# EAGLE schematic Z573 Holder Mark1 (EAGLE 9.6.2)
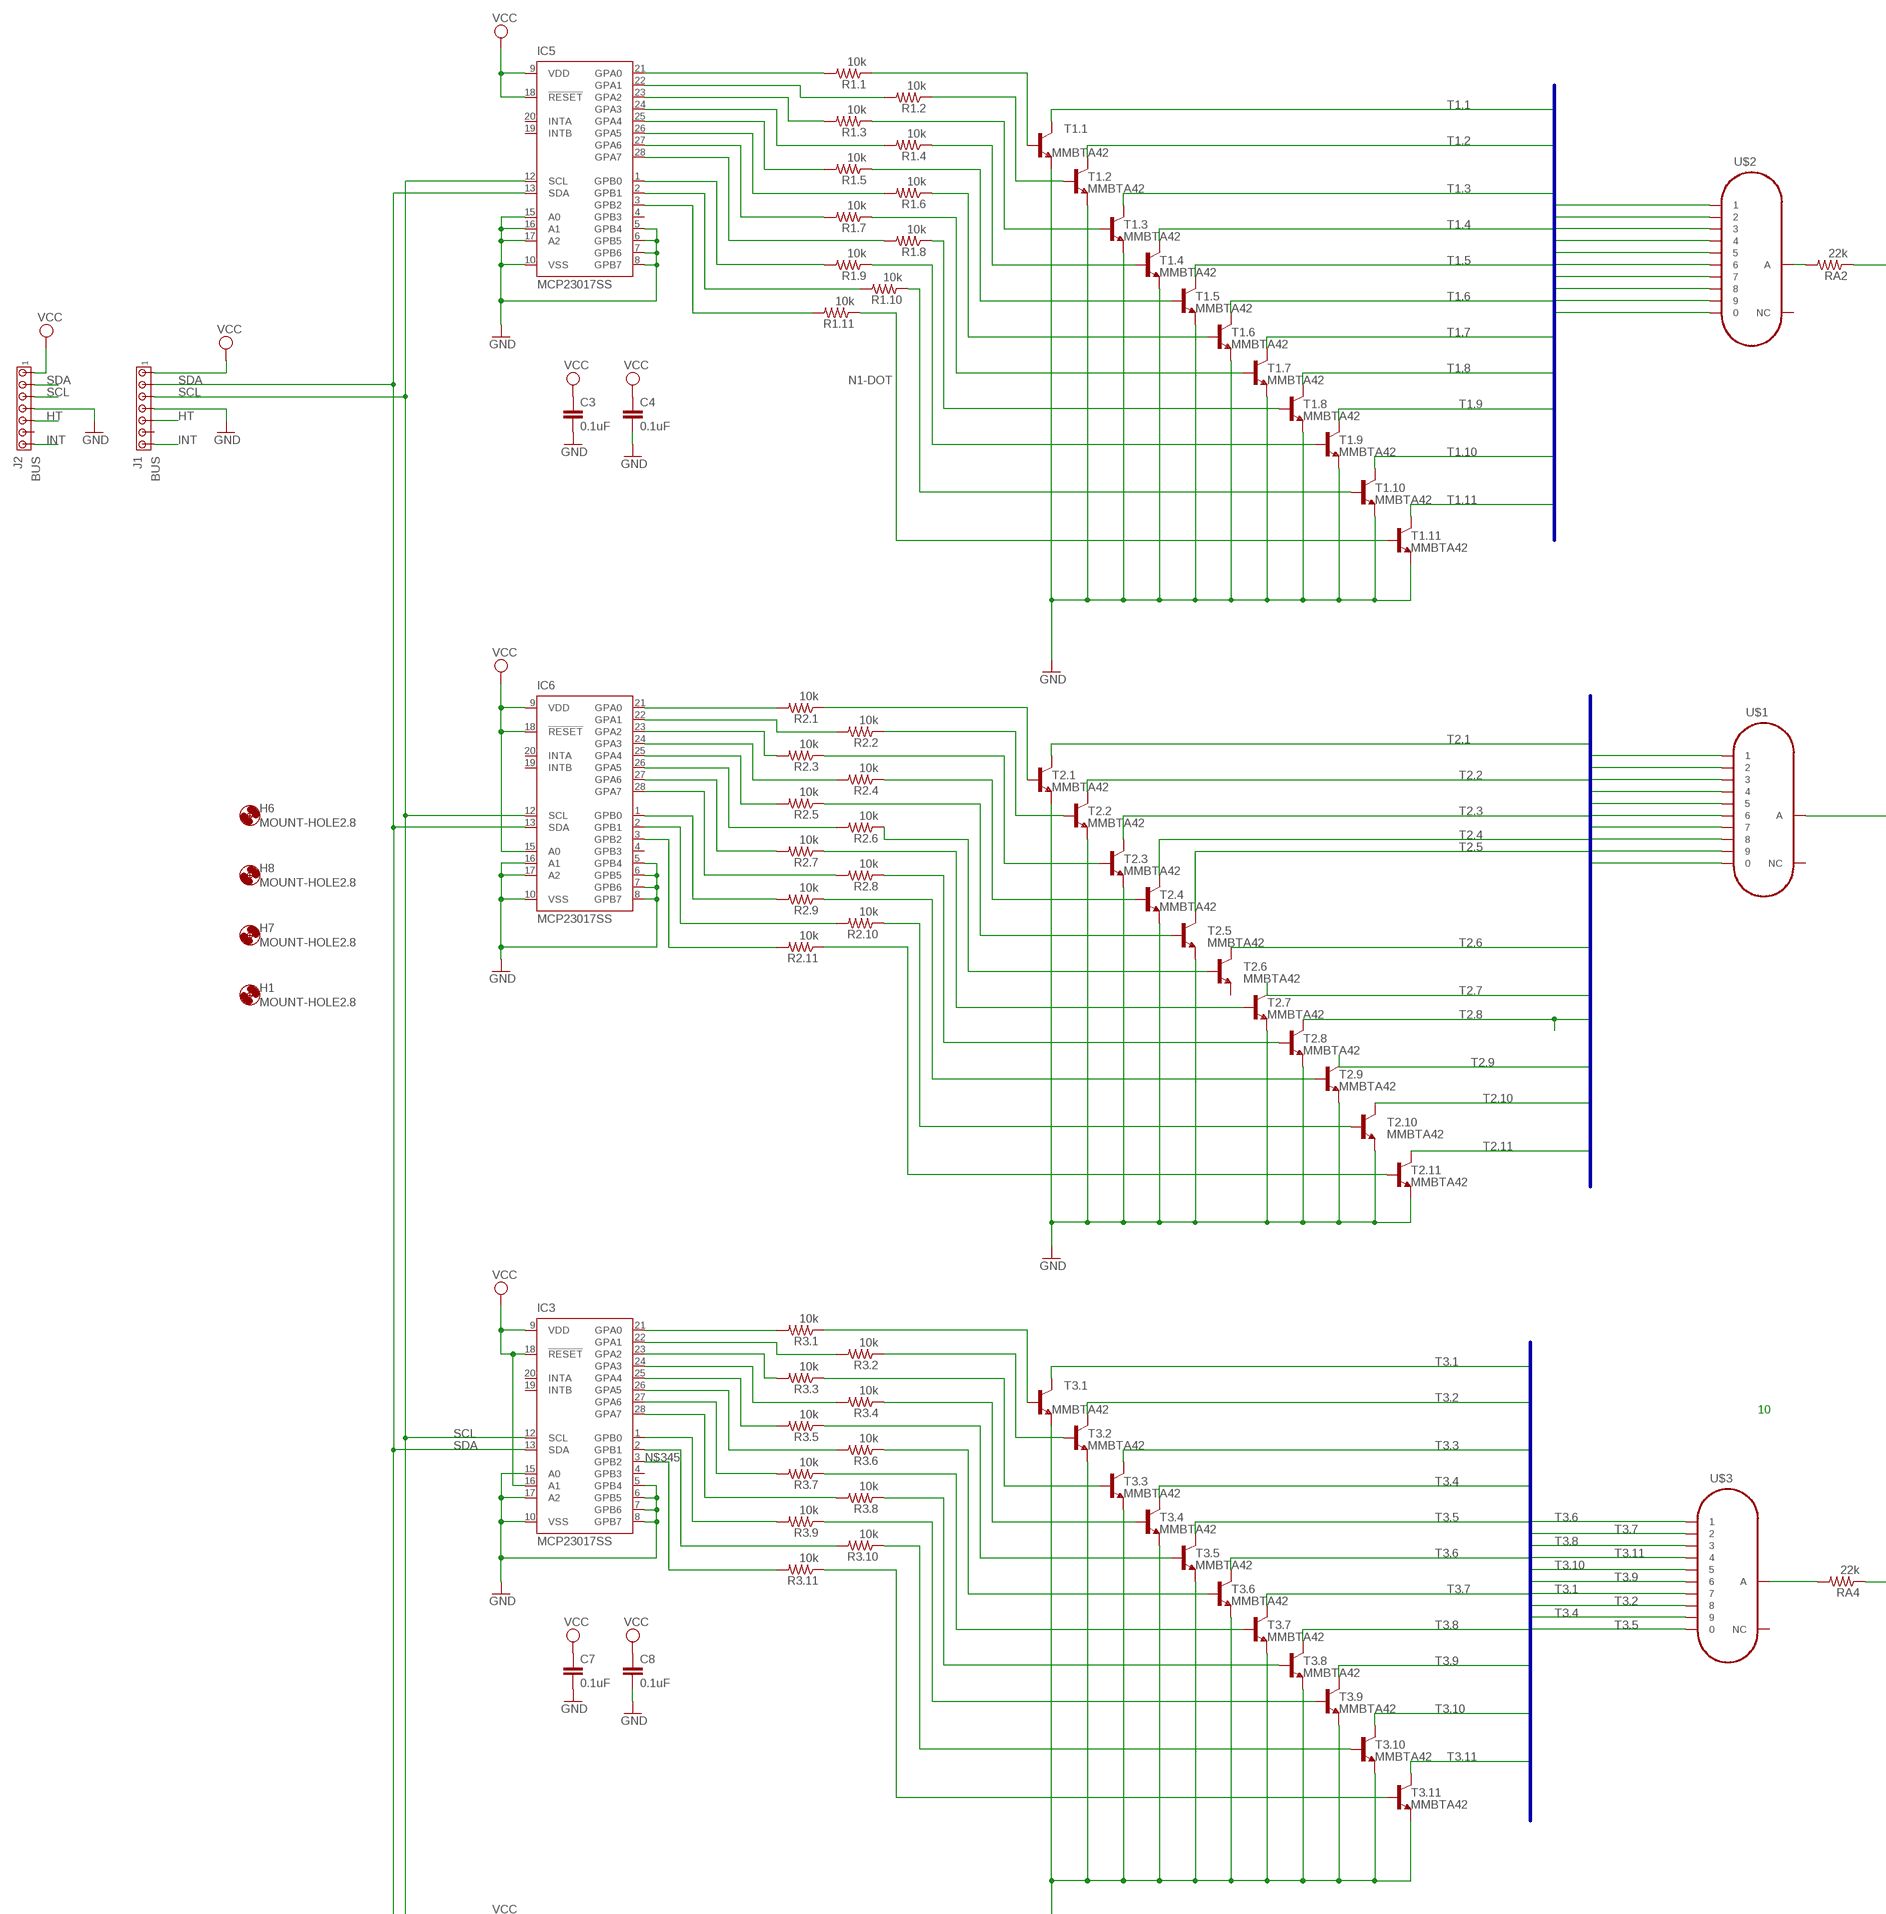
[diagram p0: schematic, sheet 1, part 1 of 3]
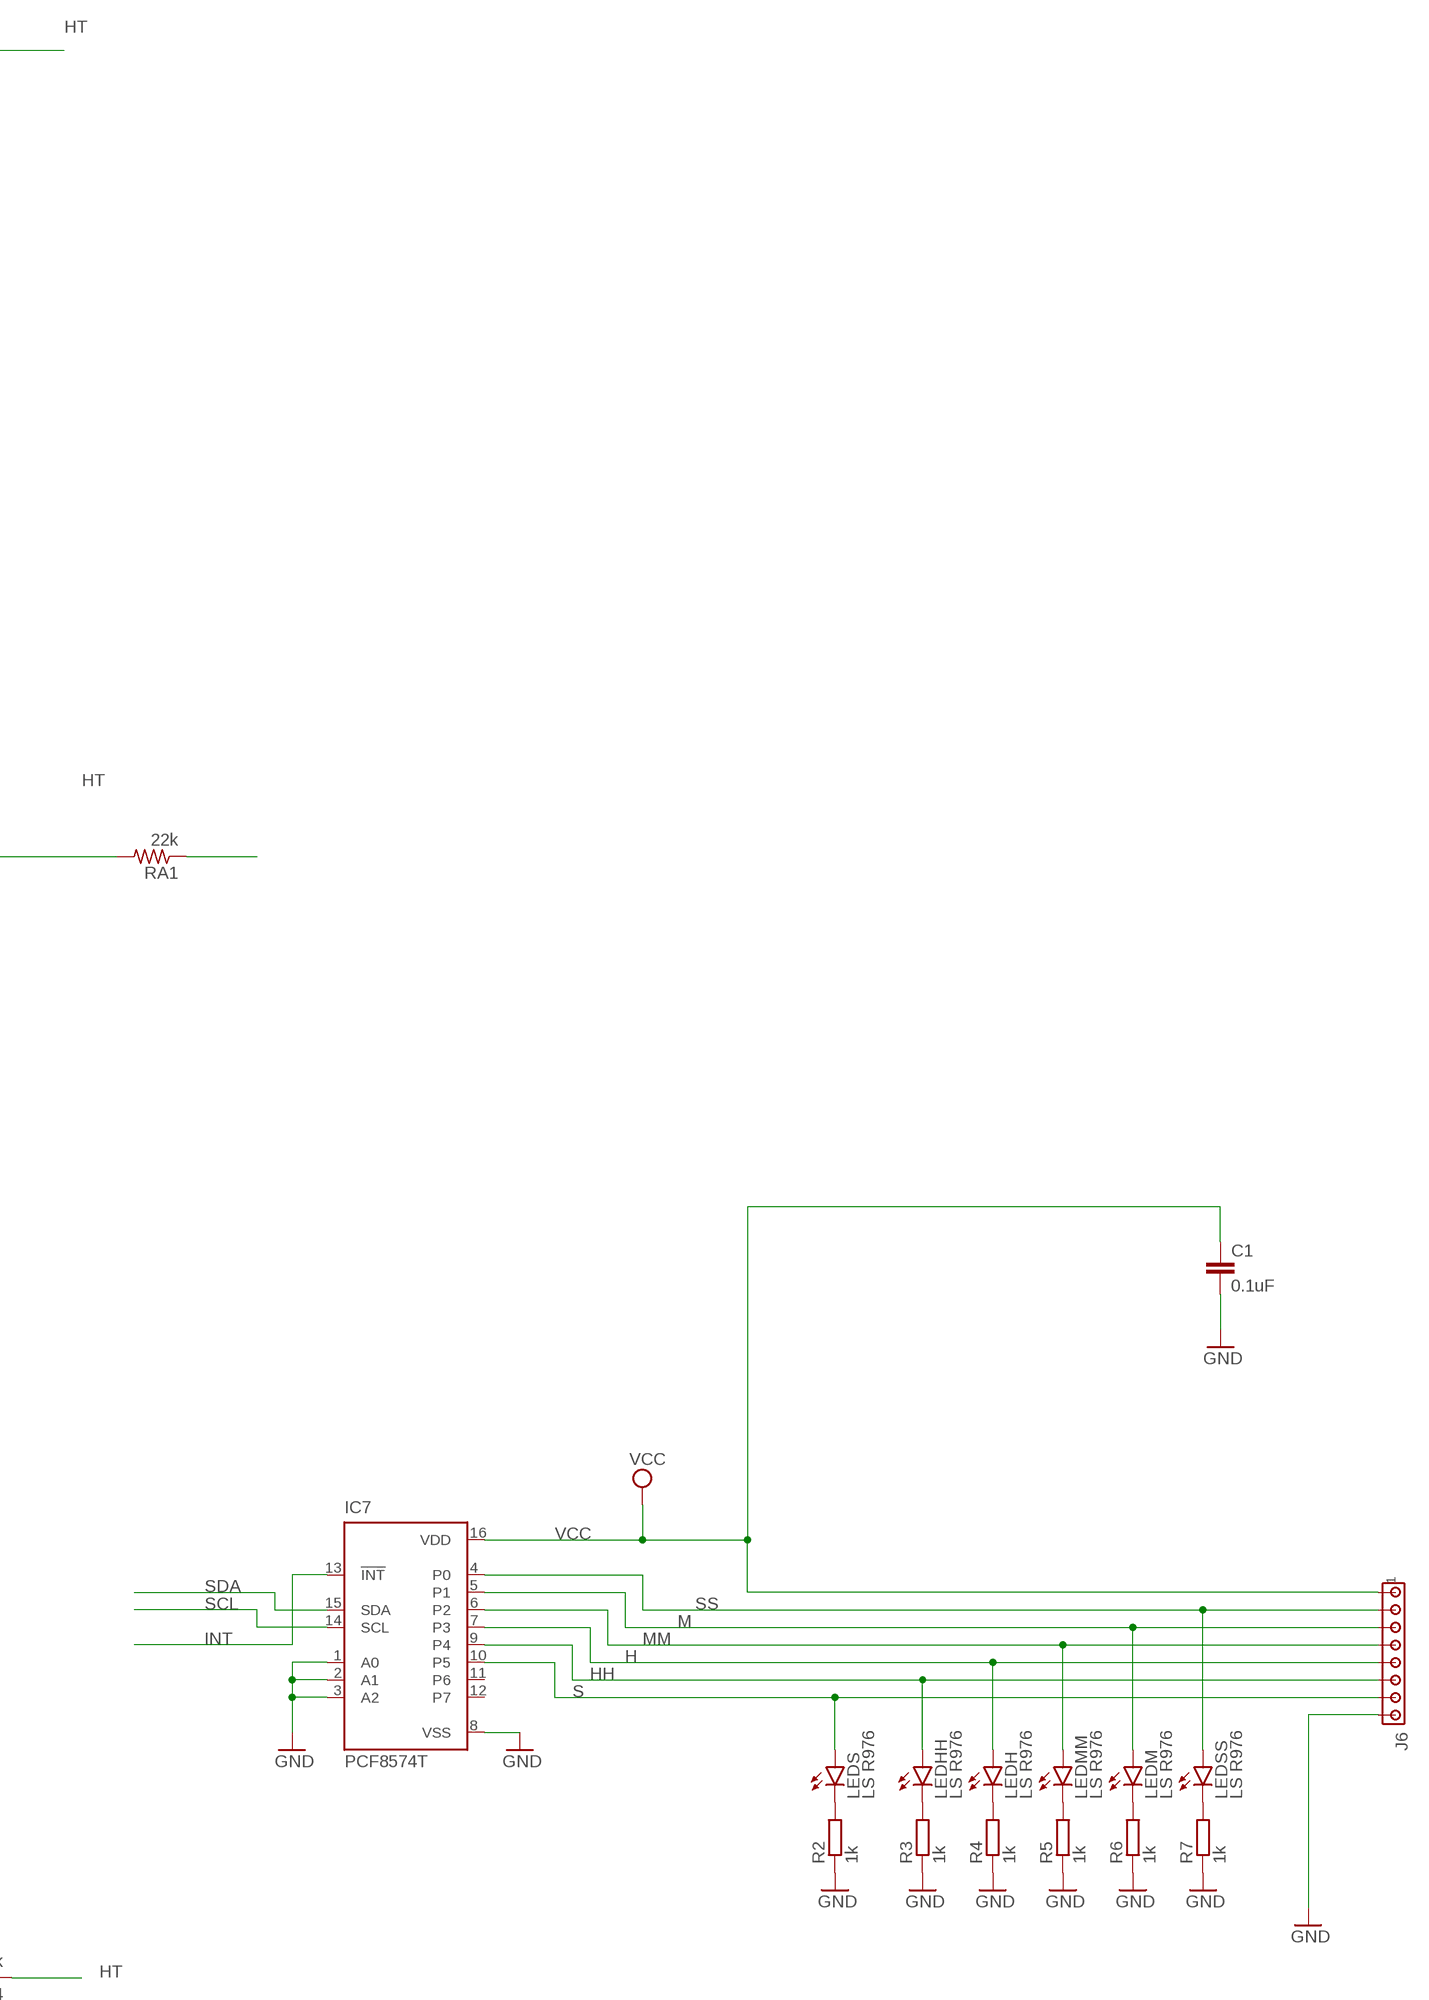
[diagram p1: schematic, sheet 1, part 2 of 3]
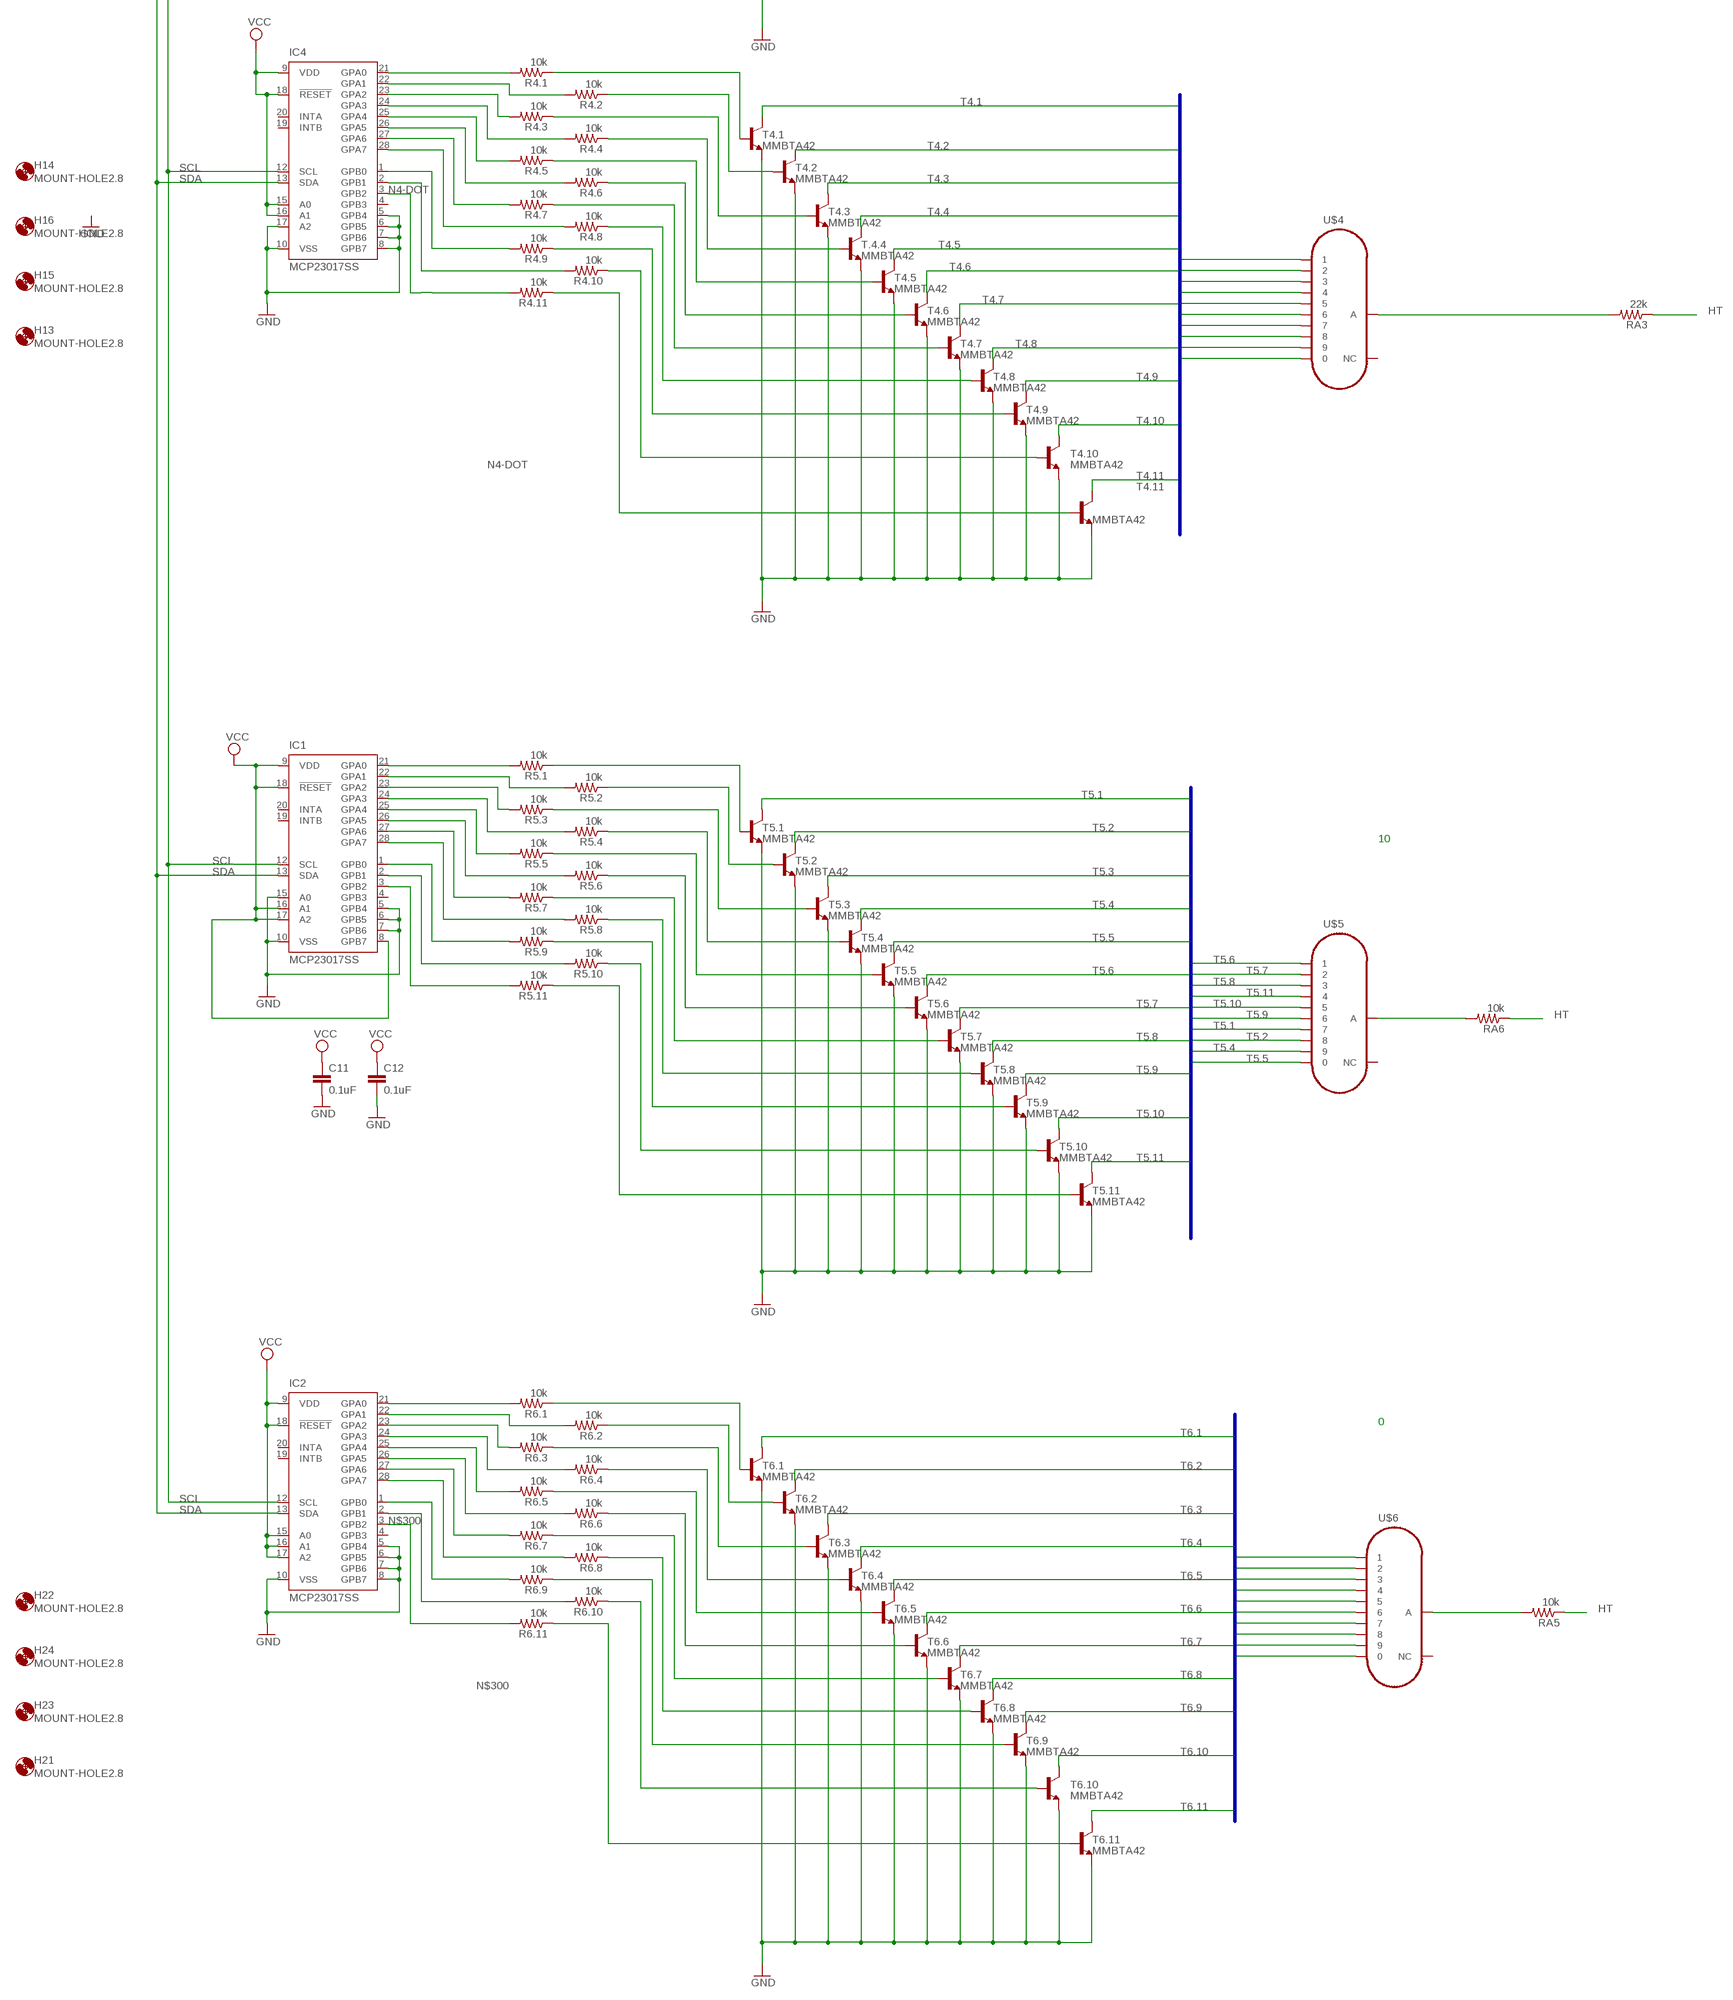
[diagram p2: schematic, sheet 1, part 3 of 3]

## Parts
C1  0.1uF  C-EUC0805  [C0805]
C3  0.1uF  C-EUC0805  [C0805]
C4  0.1uF  C-EUC0805  [C0805]
C7  0.1uF  C-EUC0805  [C0805]
C8  0.1uF  C-EUC0805  [C0805]
C11  0.1uF  C-EUC0805  [C0805]
C12  0.1uF  C-EUC0805  [C0805]
H1  MOUNT-HOLE2.8  [2,8]
H6  MOUNT-HOLE2.8  [2,8]
H7  MOUNT-HOLE2.8  [2,8]
H8  MOUNT-HOLE2.8  [2,8]
H13  MOUNT-HOLE2.8  [2,8]
H14  MOUNT-HOLE2.8  [2,8]
H15  MOUNT-HOLE2.8  [2,8]
H16  MOUNT-HOLE2.8  [2,8]
H21  MOUNT-HOLE2.8  [2,8]
H22  MOUNT-HOLE2.8  [2,8]
H23  MOUNT-HOLE2.8  [2,8]
H24  MOUNT-HOLE2.8  [2,8]
IC1  MCP23017SS  [SSOP28]
IC2  MCP23017SS  [SSOP28]
IC3  MCP23017SS  [SSOP28]
IC4  MCP23017SS  [SSOP28]
IC5  MCP23017SS  [SSOP28]
IC6  MCP23017SS  [SSOP28]
IC7  PCF8574T  [SO16W]
J1  BUS  MTA07-100  [10X07MTA]
J2  BUS  MTA07-100  [10X07MTA]
J6  MTA08-100  [10X08MTA]
LEDH  LS R976  LEDSML0805  [SML0805]
LEDHH  LS R976  LEDSML0805  [SML0805]
LEDM  LS R976  LEDSML0805  [SML0805]
LEDMM  LS R976  LEDSML0805  [SML0805]
LEDS  LS R976  LEDSML0805  [SML0805]
LEDSS  LS R976  LEDSML0805  [SML0805]
R1.1  10k  R-US_R0603  [R0603]
R1.2  10k  R-US_R0603  [R0603]
R1.3  10k  R-US_R0603  [R0603]
R1.4  10k  R-US_R0603  [R0603]
R1.5  10k  R-US_R0603  [R0603]
R1.6  10k  R-US_R0603  [R0603]
R1.7  10k  R-US_R0603  [R0603]
R1.8  10k  R-US_R0603  [R0603]
R1.9  10k  R-US_R0603  [R0603]
R1.10  10k  R-US_R0603  [R0603]
R1.11  10k  R-US_R0603  [R0603]
R2  1k  R-EU_R0805  [R0805]
R2.1  10k  R-US_R0603  [R0603]
R2.2  10k  R-US_R0603  [R0603]
R2.3  10k  R-US_R0603  [R0603]
R2.4  10k  R-US_R0603  [R0603]
R2.5  10k  R-US_R0603  [R0603]
R2.6  10k  R-US_R0603  [R0603]
R2.7  10k  R-US_R0603  [R0603]
R2.8  10k  R-US_R0603  [R0603]
R2.9  10k  R-US_R0603  [R0603]
R2.10  10k  R-US_R0603  [R0603]
R2.11  10k  R-US_R0603  [R0603]
R3  1k  R-EU_R0805  [R0805]
R3.1  10k  R-US_R0603  [R0603]
R3.2  10k  R-US_R0603  [R0603]
R3.3  10k  R-US_R0603  [R0603]
R3.4  10k  R-US_R0603  [R0603]
R3.5  10k  R-US_R0603  [R0603]
R3.6  10k  R-US_R0603  [R0603]
R3.7  10k  R-US_R0603  [R0603]
R3.8  10k  R-US_R0603  [R0603]
R3.9  10k  R-US_R0603  [R0603]
R3.10  10k  R-US_R0603  [R0603]
R3.11  10k  R-US_R0603  [R0603]
R4  1k  R-EU_R0805  [R0805]
R4.1  10k  R-US_R0603  [R0603]
R4.2  10k  R-US_R0603  [R0603]
R4.3  10k  R-US_R0603  [R0603]
R4.4  10k  R-US_R0603  [R0603]
R4.5  10k  R-US_R0603  [R0603]
R4.6  10k  R-US_R0603  [R0603]
R4.7  10k  R-US_R0603  [R0603]
R4.8  10k  R-US_R0603  [R0603]
R4.9  10k  R-US_R0603  [R0603]
R4.10  10k  R-US_R0603  [R0603]
R4.11  10k  R-US_R0603  [R0603]
R5  1k  R-EU_R0805  [R0805]
R5.1  10k  R-US_R0603  [R0603]
R5.2  10k  R-US_R0603  [R0603]
R5.3  10k  R-US_R0603  [R0603]
R5.4  10k  R-US_R0603  [R0603]
R5.5  10k  R-US_R0603  [R0603]
R5.6  10k  R-US_R0603  [R0603]
R5.7  10k  R-US_R0603  [R0603]
R5.8  10k  R-US_R0603  [R0603]
R5.9  10k  R-US_R0603  [R0603]
R5.10  10k  R-US_R0603  [R0603]
R5.11  10k  R-US_R0603  [R0603]
R6  1k  R-EU_R0805  [R0805]
R6.1  10k  R-US_R0603  [R0603]
R6.2  10k  R-US_R0603  [R0603]
R6.3  10k  R-US_R0603  [R0603]
R6.4  10k  R-US_R0603  [R0603]
R6.5  10k  R-US_R0603  [R0603]
R6.6  10k  R-US_R0603  [R0603]
R6.7  10k  R-US_R0603  [R0603]
R6.8  10k  R-US_R0603  [R0603]
R6.9  10k  R-US_R0603  [R0603]
R6.10  10k  R-US_R0603  [R0603]
R6.11  10k  R-US_R0603  [R0603]
R7  1k  R-EU_R0805  [R0805]
RA1  22k  R-US_M0805  [M0805]
RA2  22k  R-US_M0805  [M0805]
RA3  22k  R-US_M0805  [M0805]
RA4  22k  R-US_M0805  [M0805]
RA5  10k  R-US_M0805  [M0805]
RA6  10k  R-US_M0805  [M0805]
T1.1  MMBTA42  BC846  [SOT23]
T1.2  MMBTA42  BC846  [SOT23]
T1.3  MMBTA42  BC846  [SOT23]
T1.4  MMBTA42  BC846  [SOT23]
T1.5  MMBTA42  BC846  [SOT23]
T1.6  MMBTA42  BC846  [SOT23]
T1.7  MMBTA42  BC846  [SOT23]
T1.8  MMBTA42  BC846  [SOT23]
T1.9  MMBTA42  BC846  [SOT23]
T1.10  MMBTA42  BC846  [SOT23]
T1.11  MMBTA42  BC846  [SOT23]
T2.1  MMBTA42  BC846  [SOT23]
T2.2  MMBTA42  BC846  [SOT23]
T2.3  MMBTA42  BC846  [SOT23]
T2.4  MMBTA42  BC846  [SOT23]
T2.5  MMBTA42  BC846  [SOT23]
T2.6  MMBTA42  BC846  [SOT23]
T2.7  MMBTA42  BC846  [SOT23]
T2.8  MMBTA42  BC846  [SOT23]
T2.9  MMBTA42  BC846  [SOT23]
T2.10  MMBTA42  BC846  [SOT23]
T2.11  MMBTA42  BC846  [SOT23]
T3.1  MMBTA42  BC846  [SOT23]
T3.2  MMBTA42  BC846  [SOT23]
T3.3  MMBTA42  BC846  [SOT23]
T3.4  MMBTA42  BC846  [SOT23]
T3.5  MMBTA42  BC846  [SOT23]
T3.6  MMBTA42  BC846  [SOT23]
T3.7  MMBTA42  BC846  [SOT23]
T3.8  MMBTA42  BC846  [SOT23]
T3.9  MMBTA42  BC846  [SOT23]
T3.10  MMBTA42  BC846  [SOT23]
T3.11  MMBTA42  BC846  [SOT23]
T4.1  MMBTA42  BC846  [SOT23]
T4.2  MMBTA42  BC846  [SOT23]
T4.3  MMBTA42  BC846  [SOT23]
T4.5  MMBTA42  BC846  [SOT23]
T4.6  MMBTA42  BC846  [SOT23]
T4.7  MMBTA42  BC846  [SOT23]
T4.8  MMBTA42  BC846  [SOT23]
T4.9  MMBTA42  BC846  [SOT23]
T4.10  MMBTA42  BC846  [SOT23]
T4.11  MMBTA42  BC846  [SOT23]
T5.1  MMBTA42  BC846  [SOT23]
T5.2  MMBTA42  BC846  [SOT23]
T5.3  MMBTA42  BC846  [SOT23]
T5.4  MMBTA42  BC846  [SOT23]
T5.5  MMBTA42  BC846  [SOT23]
T5.6  MMBTA42  BC846  [SOT23]
T5.7  MMBTA42  BC846  [SOT23]
T5.8  MMBTA42  BC846  [SOT23]
T5.9  MMBTA42  BC846  [SOT23]
T5.10  MMBTA42  BC846  [SOT23]
T5.11  MMBTA42  BC846  [SOT23]
T6.1  MMBTA42  BC846  [SOT23]
T6.2  MMBTA42  BC846  [SOT23]
T6.3  MMBTA42  BC846  [SOT23]
T6.4  MMBTA42  BC846  [SOT23]
T6.5  MMBTA42  BC846  [SOT23]
T6.6  MMBTA42  BC846  [SOT23]
T6.7  MMBTA42  BC846  [SOT23]
T6.8  MMBTA42  BC846  [SOT23]
T6.9  MMBTA42  BC846  [SOT23]
T6.10  MMBTA42  BC846  [SOT23]
T6.11  MMBTA42  BC846  [SOT23]
T.4.4  MMBTA42  BC846  [SOT23]
U$1  Z573  [Z573M]
U$2  Z573  [Z573M]
U$3  Z573  [Z573M]
U$4  Z573  [Z573M]
U$5  Z573  [Z573M]
U$6  Z573  [Z573M]

## Nets
2-E10: R2.2.1 T2.2.1(B)
2-E11: R2.3.1 T2.3.1(B)
2-E12: R2.4.1 T2.4.1(B)
2-E13: R2.5.1 T2.5.1(B)
2-E15: R2.7.1 T2.7.1(B)
2-E16: R2.8.1 T2.8.1(B)
2-E17: R2.9.1 T2.9.1(B)
2-E18: R2.10.1 T2.10.1(B)
2-E19: R2.1.1 T2.1.1(B)
2-E30: R4.2.1 T4.2.1(B)
2-E31: R4.3.1 T4.3.1(B)
2-E32: R4.4.1 T.4.4.1(B)
2-E33: R4.5.1 T4.5.1(B)
2-E34: R4.6.1 T4.6.1(B)
2-E35: R4.7.1 T4.7.1(B)
2-E36: R4.8.1 T4.8.1(B)
2-E37: R4.9.1 T4.9.1(B)
2-E38: R4.10.1 T4.10.1(B)
2-E39: R4.1.1 T4.1.1(B)
2-E50: R6.2.1 T6.2.1(B)
2-E51: R6.3.1 T6.3.1(B)
2-E52: R6.4.1 T6.4.1(B)
2-E53: R6.5.1 T6.5.1(B)
2-E54: R6.6.1 T6.6.1(B)
2-E55: R6.7.1 T6.7.1(B)
2-E56: R6.8.1 T6.8.1(B)
2-E57: R6.9.1 T6.9.1(B)
2-E58: R6.10.1 T6.10.1(B)
2-E59: R6.1.1 T6.1.1(B)
2-R12: IC6.23(GPA2) R2.3.2
2-R16: IC6.27(GPA6) R2.7.2
2-R17: IC6.28(GPA7) R2.8.2
2-R18: IC6.1(GPB0) R2.9.2
2-R19: IC6.2(GPB1) R2.10.2
2-R30: IC4.21(GPA0) R4.1.2
2-R31: IC4.22(GPA1) R4.2.2
2-R32: IC4.23(GPA2) R4.3.2
2-R33: IC4.24(GPA3) R4.4.2
2-R34: IC4.25(GPA4) R4.5.2
2-R35: IC4.26(GPA5) R4.6.2
2-R36: IC4.27(GPA6) R4.7.2
2-R37: IC4.28(GPA7) R4.8.2
2-R38: IC4.1(GPB0) R4.9.2
2-R39: IC4.2(GPB1) R4.10.2
2-R50: IC2.21(GPA0) R6.1.2
2-R51: IC2.22(GPA1) R6.2.2
2-R52: IC2.23(GPA2) R6.3.2
2-R53: IC2.24(GPA3) R6.4.2
2-R54: IC2.25(GPA4) R6.5.2
2-R55: IC2.26(GPA5) R6.6.2
2-R56: IC2.27(GPA6) R6.7.2
2-R57: IC2.28(GPA7) R6.8.2
2-R58: IC2.1(GPB0) R6.9.2
2-R59: IC2.2(GPB1) R6.10.2
GND: C1.2 C3.2 C4.2 C7.2 C8.2 C11.2 C12.2 IC1.5(GPB4) IC1.6(GPB5) IC1.7(GPB6) IC1.10(VSS) IC1.15(A0) IC2.5(GPB4) IC2.6(GPB5) IC2.7(GPB6) IC2.8(GPB7) IC2.10(VSS) IC3.5(GPB4) IC3.6(GPB5) IC3.7(GPB6) IC3.8(GPB7) IC3.10(VSS) IC3.15(A0) IC3.17(A2) IC4.5(GPB4) IC4.6(GPB5) IC4.7(GPB6) IC4.8(GPB7) IC4.10(VSS) IC4.17(A2) IC5.5(GPB4) IC5.6(GPB5) IC5.7(GPB6) IC5.8(GPB7) IC5.10(VSS) IC5.15(A0) IC5.16(A1) IC5.17(A2) IC6.5(GPB4) IC6.6(GPB5) IC6.7(GPB6) IC6.8(GPB7) IC6.10(VSS) IC6.16(A1) IC6.17(A2) IC7.1(A0) IC7.2(A1) IC7.3(A2) IC7.8(VSS) J1.4 J2.4 J6.8 R2.1 R3.1 R4.1 R5.1 R6.1 R7.1 T1.1.2(E) T1.2.2(E) T1.3.2(E) T1.4.2(E) T1.5.2(E) T1.6.2(E) T1.7.2(E) T1.8.2(E) T1.9.2(E) T1.10.2(E) T1.11.2(E) T2.1.2(E) T2.2.2(E) T2.3.2(E) T2.4.2(E) T2.5.2(E) T2.7.2(E) T2.8.2(E) T2.9.2(E) T2.10.2(E) T2.11.2(E) T3.1.2(E) T3.2.2(E) T3.3.2(E) T3.4.2(E) T3.5.2(E) T3.6.2(E) T3.7.2(E) T3.8.2(E) T3.9.2(E) T3.10.2(E) T3.11.2(E) T4.1.2(E) T4.2.2(E) T4.3.2(E) T4.5.2(E) T4.6.2(E) T4.7.2(E) T4.8.2(E) T4.9.2(E) T4.10.2(E) T4.11.2(E) T5.1.2(E) T5.2.2(E) T5.3.2(E) T5.4.2(E) T5.5.2(E) T5.6.2(E) T5.7.2(E) T5.8.2(E) T5.9.2(E) T5.10.2(E) T5.11.2(E) T6.1.2(E) T6.2.2(E) T6.3.2(E) T6.4.2(E) T6.5.2(E) T6.6.2(E) T6.7.2(E) T6.8.2(E) T6.9.2(E) T6.10.2(E) T6.11.2(E) T.4.4.2(E)
H: IC7.7(P3) J6.5 LEDH.A
HH: IC7.9(P4) J6.6 LEDHH.A
HT: J1.5 J2.5 RA1.1 RA2.1 RA3.1 RA4.1 RA5.1 RA6.1
INT: IC7.13(!INT) J1.7 J2.7
M: IC7.5(P1) J6.3 LEDM.A
MM: IC7.6(P2) J6.4 LEDMM.A
N1-DOT: IC5.3(GPB2) R1.11.2
N4-DOT: IC4.3(GPB2) R4.11.2
N$2: IC6.24(GPA3) R2.4.2
N$3: IC6.21(GPA0) R2.1.2
N$4: IC5.24(GPA3) R1.4.2
N$5: IC6.22(GPA1) R2.2.2
N$6: IC5.26(GPA5) R1.6.2
N$7: IC5.27(GPA6) R1.7.2
N$8: IC5.28(GPA7) R1.8.2
N$9: IC5.1(GPB0) R1.9.2
N$10: IC5.2(GPB1) R1.10.2
N$12: IC6.3(GPB2) R2.11.2
N$13: R2.11.1 T2.11.1(B)
N$14: RA2.2 U$2.P$13(A)
N$15: IC5.21(GPA0) R1.1.2
N$16: IC6.25(GPA4) R2.5.2
N$17: RA4.2 U$3.P$13(A)
N$18: IC6.26(GPA5) R2.6.2
N$19: R2.6.1 T2.6.1(B)
N$27: R1.2.1 T1.2.1(B)
N$31: LEDS.C R2.2
N$32: LEDHH.C R3.2
N$33: LEDH.C R4.2
N$34: LEDMM.C R5.2
N$36: LEDM.C R6.2
N$38: LEDSS.C R7.2
N$51: R1.3.1 T1.3.1(B)
N$52: R1.4.1 T1.4.1(B)
N$53: R1.5.1 T1.5.1(B)
N$54: R1.6.1 T1.6.1(B)
N$55: R1.7.1 T1.7.1(B)
N$56: R1.8.1 T1.8.1(B)
N$57: R1.9.1 T1.9.1(B)
N$58: R1.10.1 T1.10.1(B)
N$59: R1.1.1 T1.1.1(B)
N$61: IC5.22(GPA1) R1.2.2
N$62: IC5.23(GPA2) R1.3.2
N$64: IC5.25(GPA4) R1.5.2
N$72: RA1.2 U$1.P$13(A)
N$76: R1.11.1 T1.11.1(B)
N$121: R3.2.1 T3.2.1(B)
N$132: R3.3.1 T3.3.1(B)
N$133: R3.4.1 T3.4.1(B)
N$134: R3.5.1 T3.5.1(B)
N$135: R3.6.1 T3.6.1(B)
N$136: R3.7.1 T3.7.1(B)
N$137: R3.8.1 T3.8.1(B)
N$138: R3.9.1 T3.9.1(B)
N$139: R3.10.1 T3.10.1(B)
N$140: R3.1.1 T3.1.1(B)
N$141: IC3.21(GPA0) R3.1.2
N$142: IC3.22(GPA1) R3.2.2
N$143: IC3.23(GPA2) R3.3.2
N$144: IC3.24(GPA3) R3.4.2
N$145: IC3.25(GPA4) R3.5.2
N$146: IC3.26(GPA5) R3.6.2
N$147: IC3.27(GPA6) R3.7.2
N$148: IC3.28(GPA7) R3.8.2
N$149: IC3.1(GPB0) R3.9.2
N$150: IC3.2(GPB1) R3.10.2
N$153: RA3.2 U$4.P$13(A)
N$157: R3.11.1 T3.11.1(B)
N$158: R4.11.1 T4.11.1(B)
N$201: R5.2.1 T5.2.1(B)
N$212: R5.3.1 T5.3.1(B)
N$213: R5.4.1 T5.4.1(B)
N$214: R5.5.1 T5.5.1(B)
N$215: R5.6.1 T5.6.1(B)
N$216: R5.7.1 T5.7.1(B)
N$217: R5.8.1 T5.8.1(B)
N$218: R5.9.1 T5.9.1(B)
N$219: R5.10.1 T5.10.1(B)
N$220: R5.1.1 T5.1.1(B)
N$221: IC1.21(GPA0) R5.1.2
N$222: IC1.22(GPA1) R5.2.2
N$223: IC1.23(GPA2) R5.3.2
N$224: IC1.24(GPA3) R5.4.2
N$225: IC1.25(GPA4) R5.5.2
N$226: IC1.26(GPA5) R5.6.2
N$227: IC1.27(GPA6) R5.7.2
N$228: IC1.28(GPA7) R5.8.2
N$229: IC1.1(GPB0) R5.9.2
N$230: IC1.2(GPB1) R5.10.2
N$233: RA5.2 U$6.P$13(A)
N$237: R5.11.1 T5.11.1(B)
N$238: R6.11.1 T6.11.1(B)
N$240: RA6.2 U$5.P$13(A)
N$250: IC1.3(GPB2) R5.11.2
N$300: IC2.3(GPB2) R6.11.2
N$345: IC3.3(GPB2) R3.11.2
S: IC7.10(P5) J6.7 LEDS.A
SCL: IC1.12(SCL) IC2.12(SCL) IC3.12(SCL) IC4.12(SCL) IC5.12(SCL) IC6.12(SCL) IC7.14(SCL) J1.3 J2.3
SDA: IC1.13(SDA) IC2.13(SDA) IC3.13(SDA) IC4.13(SDA) IC5.13(SDA) IC6.13(SDA) IC7.15(SDA) J1.2 J2.2
SS: IC7.4(P0) J6.2 LEDSS.A
T1.1: T1.1.3(C) U$2.P$8
T1.2: T1.2.3(C) U$2.P$9
T1.3: T1.3.3(C)
T1.4: T1.4.3(C) U$2.P$11
T1.5: T1.5.3(C) U$2.P$12
T1.6: T1.6.3(C) U$2.P$1
T1.7: T1.7.3(C) U$2.P$2
T1.8: T1.8.3(C) U$2.P$3
T1.9: T1.9.3(C) U$2.P$7
T1.10: T1.10.3(C) U$2.P$6
T1.11: T1.11.3(C) U$2.P$5
T2.1: T2.1.3(C) U$1.P$7
T2.2: T2.2.3(C) U$1.P$6
T2.3: T2.3.3(C) U$1.P$5
T2.4: T2.4.3(C) U$1.P$3
T2.5: T2.5.3(C) U$1.P$2
T2.6: T2.6.3(C) U$1.P$1
T2.7: T2.7.3(C) U$1.P$12
T2.8: T2.8.3(C) U$1.P$11
T2.9: T2.9.3(C) U$1.P$8
T2.10: T2.10.3(C) U$1.P$9
T2.11: T2.11.3(C)
T3.1: T3.1.3(C) U$3.P$8
T3.2: T3.2.3(C) U$3.P$9
T3.3: T3.3.3(C)
T3.4: T3.4.3(C) U$3.P$11
T3.5: T3.5.3(C) U$3.P$12
T3.6: T3.6.3(C) U$3.P$1
T3.7: T3.7.3(C) U$3.P$2
T3.8: T3.8.3(C) U$3.P$3
T3.9: T3.9.3(C) U$3.P$7
T3.10: T3.10.3(C) U$3.P$6
T3.11: T3.11.3(C) U$3.P$5
T4.1: T4.1.3(C) U$4.P$7
T4.2: T4.2.3(C) U$4.P$6
T4.3: T4.3.3(C) U$4.P$5
T4.4: T.4.4.3(C) U$4.P$3
T4.5: T4.5.3(C) U$4.P$2
T4.6: T4.6.3(C) U$4.P$1
T4.7: T4.7.3(C) U$4.P$12
T4.8: T4.8.3(C) U$4.P$11
T4.9: T4.9.3(C) U$4.P$8
T4.10: T4.10.3(C) U$4.P$9
T4.11: T4.11.3(C)
T5.1: T5.1.3(C) U$5.P$8
T5.2: T5.2.3(C) U$5.P$9
T5.3: T5.3.3(C)
T5.4: T5.4.3(C) U$5.P$11
T5.5: T5.5.3(C) U$5.P$12
T5.6: T5.6.3(C) U$5.P$1
T5.7: T5.7.3(C) U$5.P$2
T5.8: T5.8.3(C) U$5.P$3
T5.9: T5.9.3(C) U$5.P$7
T5.10: T5.10.3(C) U$5.P$6
T5.11: T5.11.3(C) U$5.P$5
T6.1: T6.1.3(C) U$6.P$7
T6.2: T6.2.3(C) U$6.P$6
T6.3: T6.3.3(C) U$6.P$5
T6.4: T6.4.3(C) U$6.P$3
T6.5: T6.5.3(C) U$6.P$2
T6.6: T6.6.3(C) U$6.P$1
T6.7: T6.7.3(C) U$6.P$12
T6.8: T6.8.3(C) U$6.P$11
T6.9: T6.9.3(C) U$6.P$8
T6.10: T6.10.3(C) U$6.P$9
T6.11: T6.11.3(C)
VCC: C1.1 C3.1 C4.1 C7.1 C8.1 C11.1 C12.1 IC1.8(GPB7) IC1.9(VDD) IC1.16(A1) IC1.17(A2) IC1.18(!RESET) IC2.9(VDD) IC2.15(A0) IC2.16(A1) IC2.17(A2) IC2.18(!RESET) IC3.9(VDD) IC3.16(A1) IC3.18(!RESET) IC4.9(VDD) IC4.15(A0) IC4.16(A1) IC4.18(!RESET) IC5.9(VDD) IC5.18(!RESET) IC6.9(VDD) IC6.15(A0) IC6.18(!RESET) IC7.16(VDD) J1.1 J2.1 J6.1
Unconnected: IC1.4(GPB3) IC1.19(INTB) IC1.20(INTA) IC2.4(GPB3) IC2.19(INTB) IC2.20(INTA) IC3.4(GPB3) IC3.19(INTB) IC3.20(INTA) IC4.4(GPB3) IC4.19(INTB) IC4.20(INTA) IC5.4(GPB3) IC5.19(INTB) IC5.20(INTA) IC6.4(GPB3) IC6.19(INTB) IC6.20(INTA) IC7.11(P6) IC7.12(P7) J1.6 J2.6 T2.6.2(E) U$1.P$4(NC) U$2.P$4(NC) U$3.P$4(NC) U$4.P$4(NC) U$5.P$4(NC) U$6.P$4(NC)

## Buses
T4.1,T4.2,T4.3,T4.4,T4.5,T4.6,T4.7,T4.8,T4.9,T4.10,T4.11
T5.1,T5.2,T5.3,T5.4,T5.5,T5.6,T5.7,T5.8,T5.9,T5.10,T5.11
T6.1,T6.2,T6.3,T6.4,T6.5,T6.6,T6.7,T6.8,T6.9,T6.10,T6.11
T3.1,T3.2,T3.3,T3.4,T3.5,T3.6,T3.7,T3.8,T3.9,T3.10,T3.11
HT,N$78,N$79,T1.1,T1.2,T1.3,T1.4,T1.5,T1.6,T1.7,T1.8,T1.9,T1.10,T1.11
T2.1,T2.2,T2.3,T2.4,T2.5,T2.6,T2.7,T2.8,T2.9,T2.10,T2.11

## Notes on the sheet
- 10
- 10
- 0

## Library data of the parts
C1 C3 C4 C7 C8 C11 C12 = rcl:C-EU: CAPACITOR, European symbol; SPICEPREFIX: C
H1 H6-H8 H13-H16 H21-H24 = holes:MOUNT-HOLE: MOUNTING HOLE with drill center marker
IC1-IC6 = adafruit:MCP23017: http://ww1.microchip.com/downloads/en/DeviceDoc/21952a.pdf Source: http://ww1.microchip.com/downloads/en/DeviceDoc/21952a.pdf
IC7 = micro-philips:PCF8574: I2C-Bus Remote 8-bit I/O expander http://www.semiconductors.philips.com/acrobat_download/datasheets/PCF8574_4.pdf; MPN: PCF8574T/3,512; OC_FARNELL: 1201255; OC_NEWARK: 70R6870
J1 J2 = con-amp:MTA07-100: AMP connector
J6 = con-amp:MTA08-100: AMP connector
LEDH LEDHH LEDM LEDMM LEDS LEDSS = led:LED: LED OSRAM: - CHIPLED LG R971, LG N971, LY N971, LG Q971, LY Q971, LO R971, LY R971 LH N974, LH R974 LS Q976, LO Q976, LY Q976 LO Q996 - Hyper CHIPLED LW Q18S LB Q993, LB Q99A, LB R99A - SideLED LS A670, LO A670, LY A670, LG A670, LP A670 LB A673, LV A673, LT A673, LW A673 LH A674 LY A675 LS A676, LA A676, LO A676, LY A676, LW A676 LS A679, LY A679, LG A679 - Hyper Micro SIDELED® LS Y876, LA Y876, LO Y876, LY Y876 LT Y87S - SmartLED LW L88C, LW L88S LB L89C, LB L89S, LG L890 LS L89K, LO L89K, LY L89K LS L896, LA L896, LO L896, LY L896 - TOPLED LS T670, LO T670, LY T670, LG T670, LP T670 LSG T670, LSP T670, LSY T670, LOP T670, LYG T670 LG T671, LOG T671, LSG T671 LB T673, LV T673, LT T673, LW T673 LH T674 LS T676, LA T676, LO T676, LY T676, LB T676, LH T676, LSB T676, LW T676 LB T67C, LV T67C, LT T67C, LS T67K, LO T67K, LY T67K, LW E67C LS E67B, LA E67B, LO E67B, LY E67B, LB E67C, LV E67C, LT E67C LW T67C LS T679, LY T679, LG T679 LS T770, LO T770, LY T770, LG T770, LP T770 LB T773, LV T773, LT T773, LW T773 LH T774 LS E675, LA E675, LY E675, LS T675 LS T776, LA T776, LO T776, LY T776, LB T776 LHGB T686 LT T68C, LB T68C - Hyper Mini TOPLED® LB M676 - Mini TOPLED Santana® LG M470 LS M47K, LO M47K, LY M47K Source: http://www.osram.convergy.de LUXEON: - LUMILED® LXK2-PW12-R00, LXK2-PW12-S00, LXK2-PW14-U00, LXK2-PW14-V00 LXK2-PM12-R00, LXK2-PM12-S00, LXK2-PM14-U00 LXK2-PE12-Q00, LXK2-PE12-R00, LXK2-PE12-S00, LXK2-PE14-T00, LXK2-PE14-U00 LXK2-PB12-K00, LXK2-PB12-L00, LXK2-PB12-M00, LXK2-PB14-N00, LXK2-PB14-P00, LXK2-PB14-Q00 LXK2-PR12-L00, LXK2-PR12-M00, LXK2-PR14-Q00, LXK2-PR14-R00 LXK2-PD12-Q00, LXK2-PD12-R00, LXK2-PD12-S00 LXK2-PH12-R00, LXK2-PH12-S00 LXK2-PL12-P00, LXK2-PL12-Q00, LXK2-PL12-R00 Source: www.luxeon.com KINGBRIGHT: KA-3528ASYC Source: www.kingbright.com
R1.1-R1.11 R2.1-R2.11 R3.1-R3.11 R4.1-R4.11 R5.1-R5.11 R6.1-R6.11 RA1-RA6 = adafruit:R-US_: RESISTOR, American symbol
R2-R7 = rcl:R-EU_: RESISTOR, European symbol; SPICEPREFIX: R
T1.1-T1.11 T2.1-T2.11 T3.1-T3.11 T4.1-T4.3 T4.5-T4.11 T5.1-T5.11 T6.1-T6.11 T.4.4 = transistor:BC846: NPN TRANSISTOR
U$1-U$6 = russian-nixies:Z573